# EAGLE board Hive 1.7 (EAGLE 9.6.2), part 1 of 2
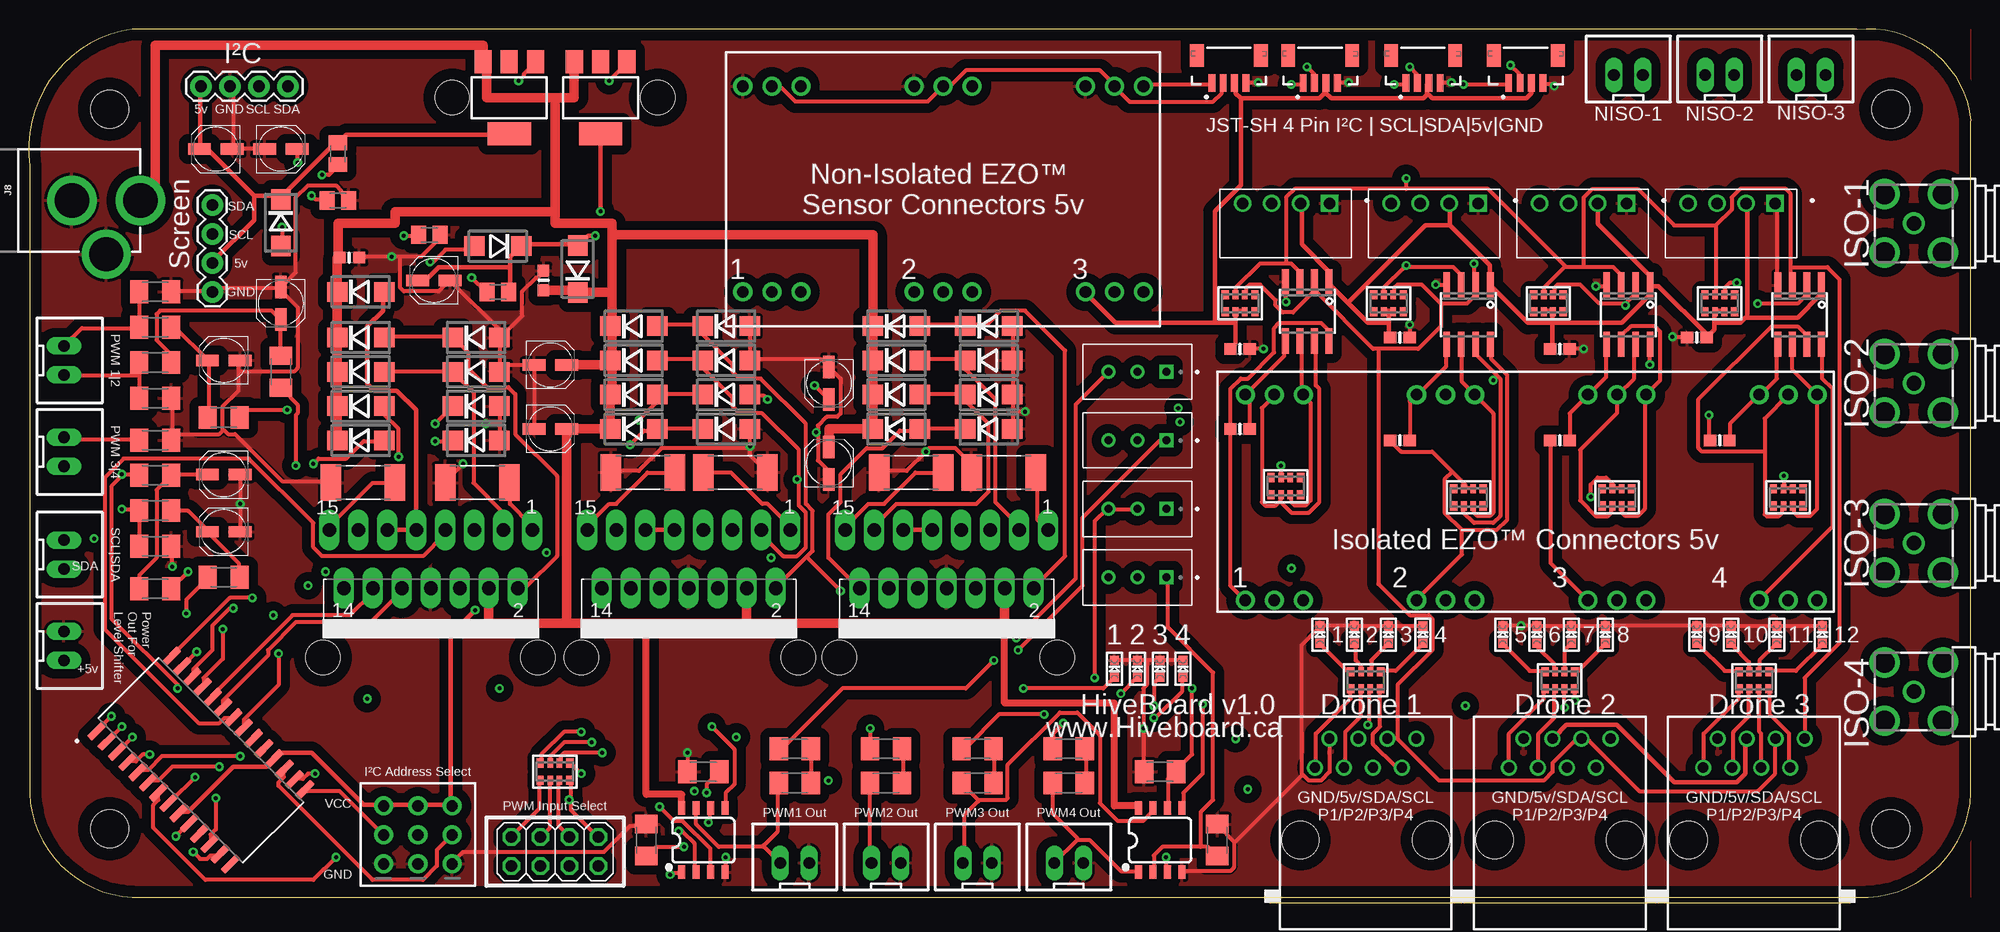
[diagram p2: board, top side]
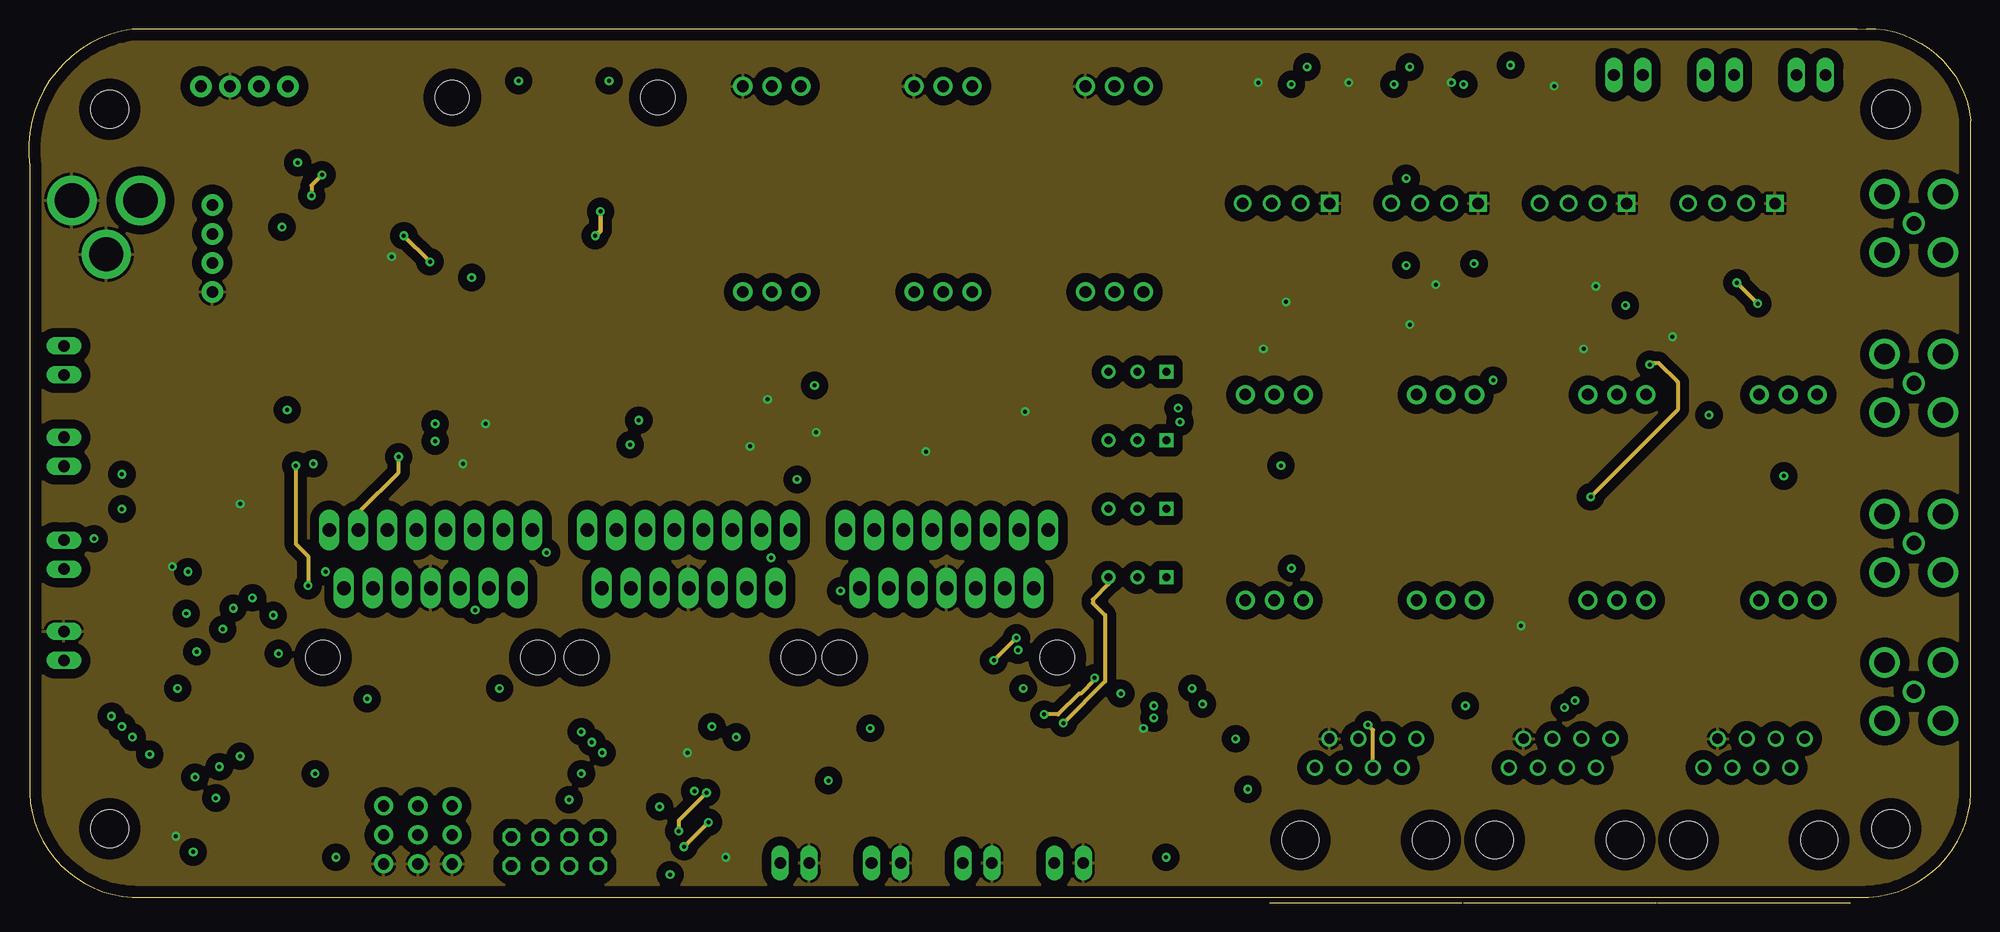
[diagram p3: board, inner layer Route2]
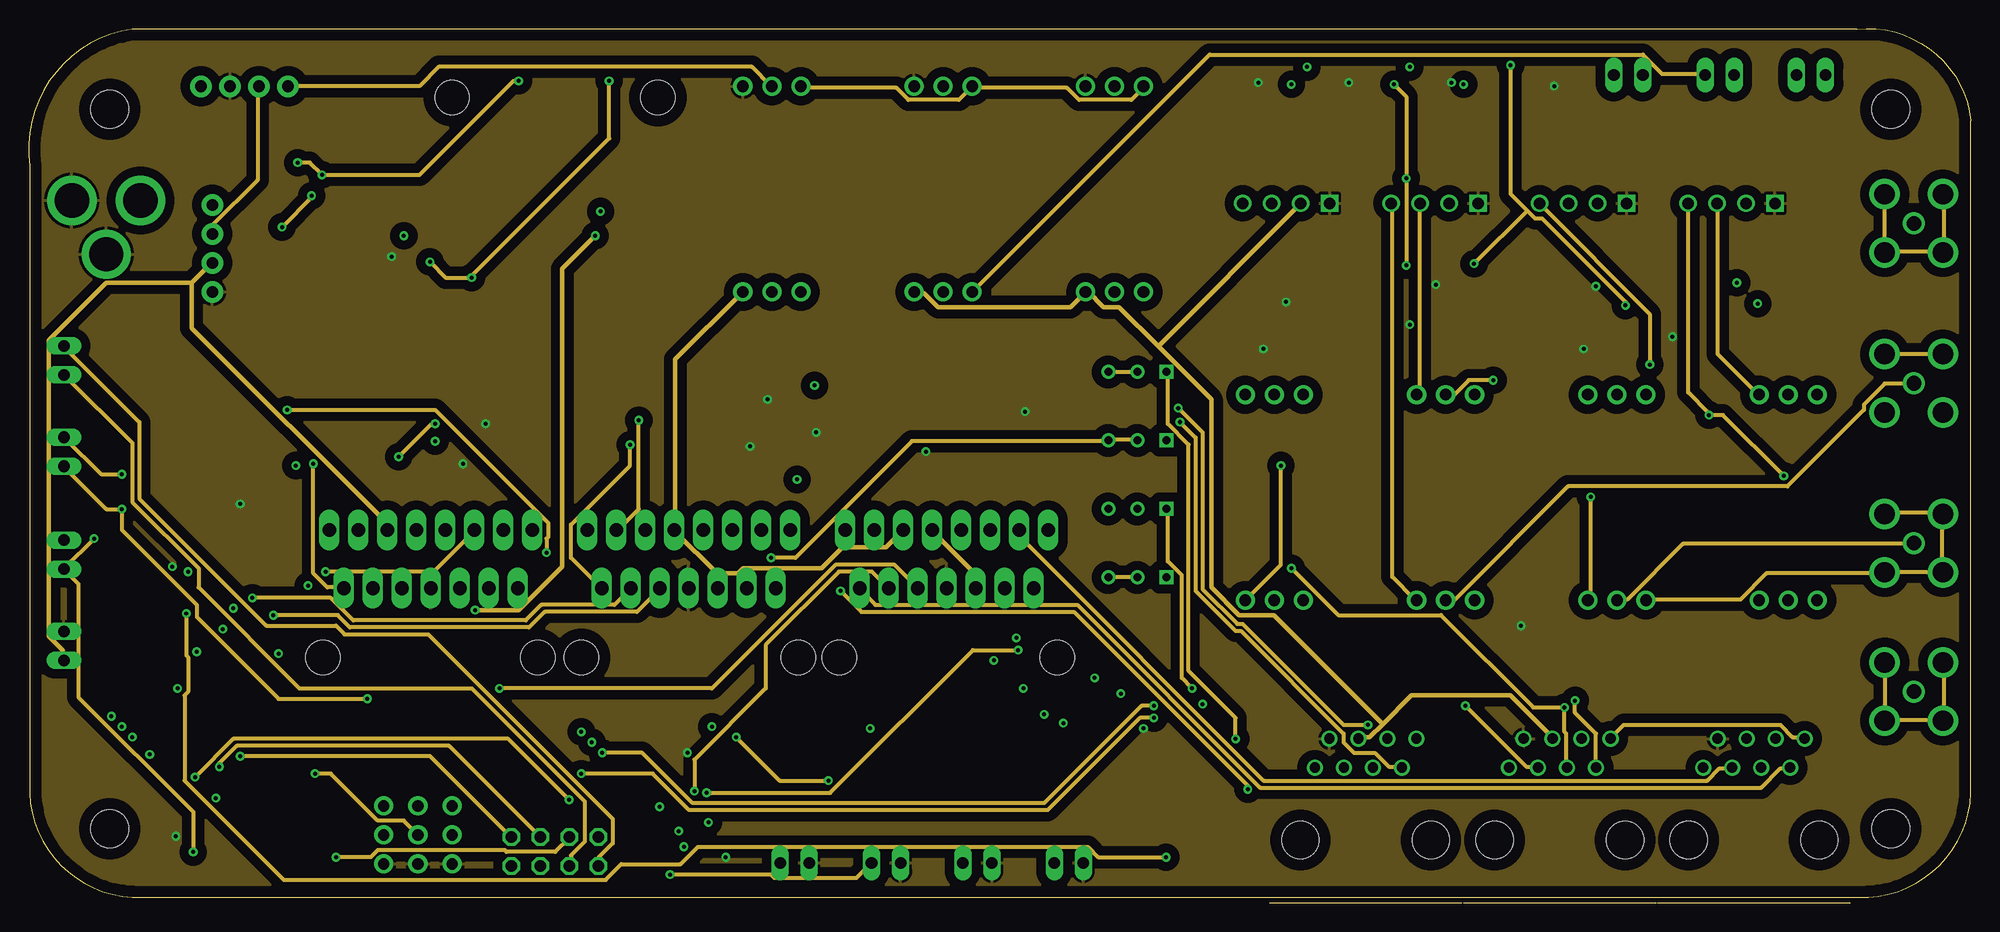
[diagram p4: board, inner layer Route15]
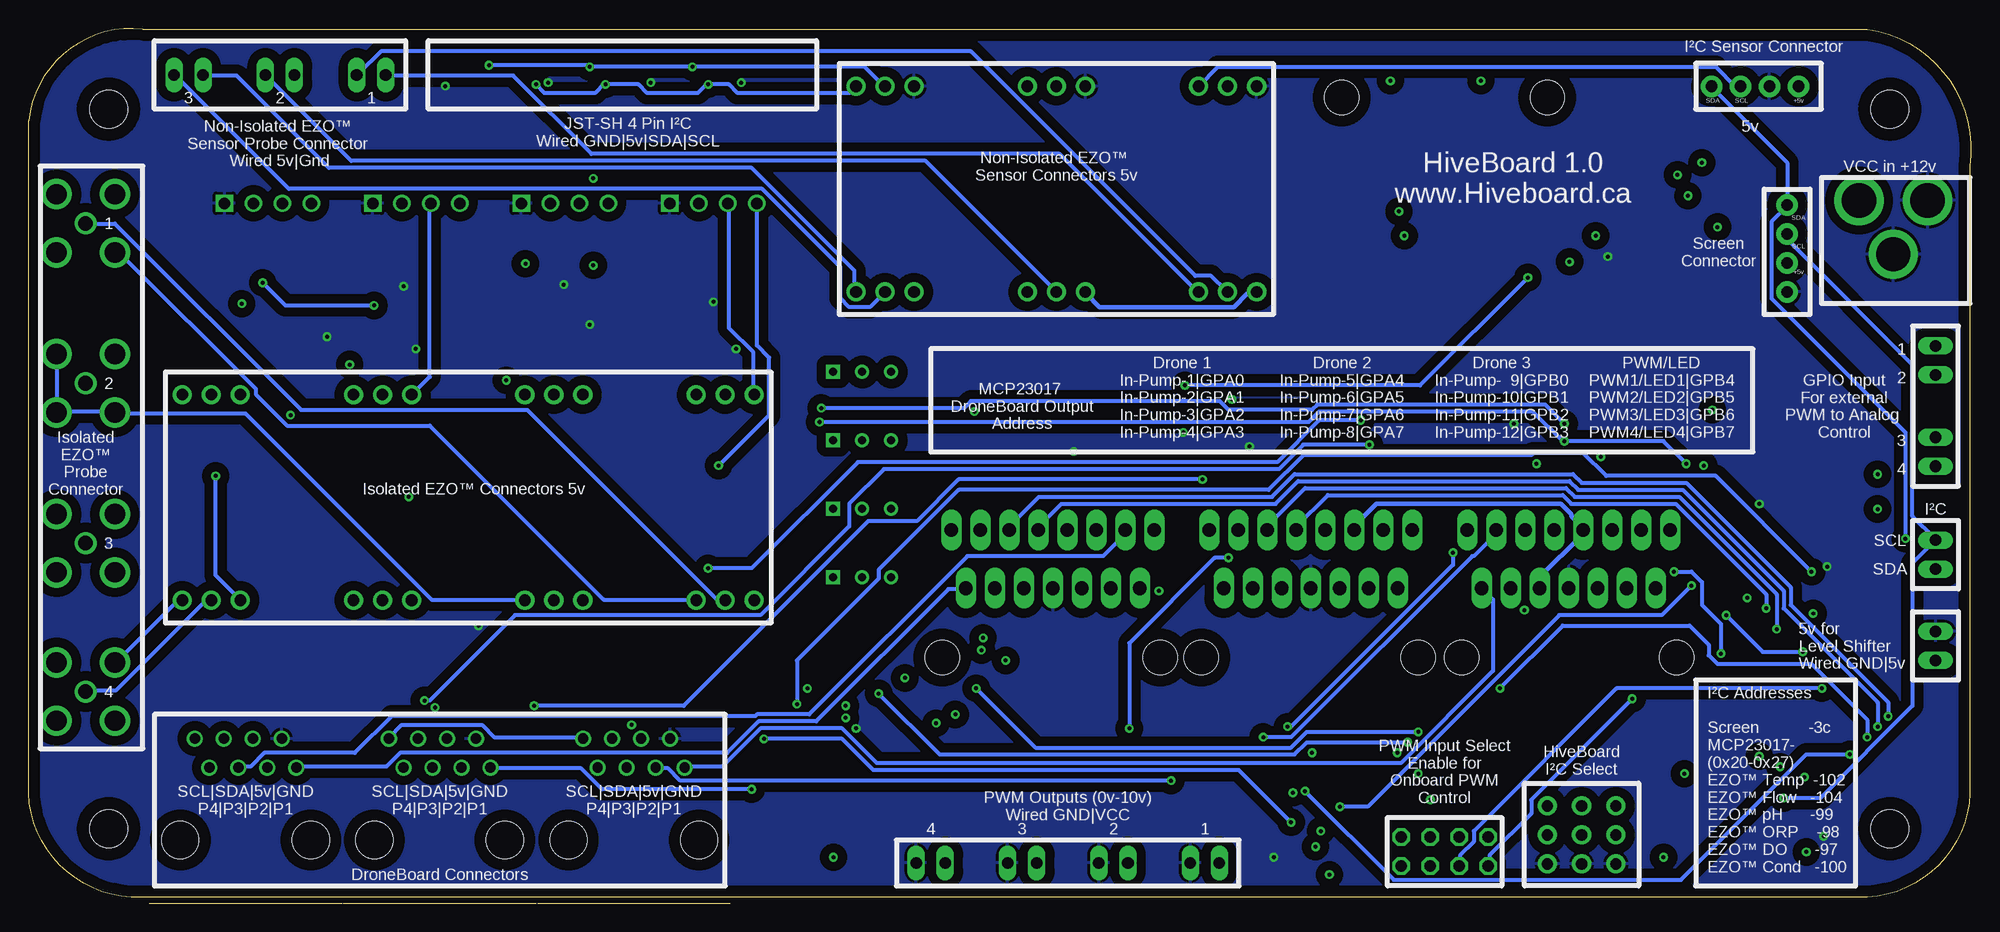
[diagram p5: board, bottom side, seen from below]

Size 170.1 x 76.05 mm. Coordinates in mm from the lower left corner, seen from the top.
Outline: 9.1,0 161.1,0 arc90 170.1,10 170.1,68 arc90 160.1,76 9.1,76 arc90 0.1,64 0.1,10 arc90 9.1,0
Copper layers (1+2*15+16): Top 0.035mm / dielectric 1.5mm / Route2 0.035mm / dielectric 0.15mm / Route15 0.035mm / dielectric 0.2mm / Bottom 0.035mm
Design rules "default *": minimum track width 6mil, minimum drill 0.35mm, track to track 6mil, track to pad 6mil, pad to pad 6mil, via to via 6mil, smd to smd 6mil, copper to edge 40mil, drill to drill 6mil, minimum pad ring 10mil, minimum via ring 8mil, stop-mask expansion 4mil, vias tented up to drill 0mil, thermal gap 10mil
Net classes: 0 default: width 0.356 mm, drill 0.102 mm, clearance 0.254 mm; 1 highpower: width 0.356 mm, drill 0.356 mm; 2 12v: width 0.457 mm, drill 0.102 mm, clearance 0.254 mm; 3 5v: width 0.406 mm, drill 0.102 mm, clearance 0.254 mm; 4 3.3v: width 0.406 mm, drill 0.102 mm, clearance 0.254 mm; 5 i2c: width 0.356 mm, drill 0.102 mm, clearance 0.254 mm; 6 GPIO: width 0.356 mm, drill 0.102 mm, clearance 0.254 mm; 8 New Class: drill 0.102 mm, clearance 0.152 mm
Holes 3 mm at 55.1,70 37.1,70 48.4,21 67.4,21 71,21 90.1,21 25.8,21 44.6,21

## Footprints (pad centres in the part's own frame; a part is rotated, then mirrored left to right if it is on the bottom)
UD-4X5,8_NICHICON = smd 2 x 1: + 1.425,0; - -1.425,0
0603-NO = smd 1.075 x 1: 1 -0.85,0; 2 0.85,0
DO214BA = smd 1.8 x 1.7: A 2.05,0; C -2.05,0
STAND-OFF = hole 3.302: 0,0
SOT223 = smd 1.5 x 2: 1 -2.3,-3.15; 2 0,-3.15; 3 2.3,-3.15 | smd 3.8 x 2: 4 0,3.15
MULTIWATT-15 = drill 1.2 long: 1 -8.89,-7.62; 2 -7.62,-2.54; 3 -6.35,-7.62; 4 -5.08,-2.54; 5 -3.81,-7.62; 6 -2.54,-2.54; 7 -1.27,-7.62; 8 0,-2.54; 9 1.27,-7.62; 10 2.54,-2.54; 11 3.81,-7.62; 12 5.08,-2.54; 13 6.35,-7.62; 14 7.62,-2.54; 15 8.89,-7.62
JST04_1MM_VERT = smd 0.6 x 1.55: 1 -1.478,0.775; 2 -0.478,0.775; 3 0.522,0.775; 4 1.522,0.775 | smd 1.2 x 2: NC1 -2.778,3.2; NC2 2.822,3.2
1X04 = drill 1.016 pad 1.88: 1 0,0; 2 2.54,0; 3 5.08,0; 4 7.62,0
POWER_JACK_PTH = drill 2.997 pad 4.318: GND 0,7.7; GNDBREAK 4.7,10.7; PWR 0,13.7
1X03_ROUND = drill 1 pad 1.676: 1 -2.54,0; 2 0,0; 3 2.54,0
2X04 = drill 1.016 octagon: 1 -3.81,-1.27; 2 -3.81,1.27; 3 -1.27,-1.27; 4 -1.27,1.27; 5 1.27,-1.27; 6 1.27,1.27; 7 3.81,-1.27; 8 3.81,1.27
1X03-CLEANBIG = drill 1.016 pad 1.676: 1 -2.54,0; 2 0,0; 3 2.54,0
CHIPLED_0603 = smd 0.8 x 0.8: A 0,-0.75; C 0,0.75
CONV_RFM-0505S = drill 1 square: 1 -3.85,-1.75 | drill 1: 2 -1.31,-1.75; 3 1.23,-1.75; 4 3.77,-1.75
R2512 = smd 1.8 x 3.2: 1 -2.8,0; 2 2.8,0
M1206 = smd 1.6 x 2: 1 -1.4,0; 2 1.4,0
M0805 = smd 1.3 x 1.6: 1 -0.95,0; 2 0.95,0
TRIM_3296W-1-103 = drill 0.71 square: 1 -2.54,0 | drill 0.71: 2 0,0; 3 2.54,0
RESPACK_4X0603 = smd 0.65 x 0.8: 1 -1.3,-0.75; 4 1.3,-0.75; 5 1.3,0.75; 8 -1.3,0.75 | smd 0.5 x 0.8: 2 -0.4,-0.75; 3 0.4,-0.75; 6 0.4,0.75; 7 -0.4,0.75
SOIC127P1030X265-28N = smd 1.9 x 0.6: 1 -4.605,8.255; 2 -4.605,6.985; 3 -4.605,5.715; 4 -4.605,4.445; 5 -4.605,3.175; 6 -4.605,1.905; 7 -4.605,0.635; 8 -4.605,-0.635; 9 -4.605,-1.905; 10 -4.605,-3.175; 11 -4.605,-4.445; 12 -4.605,-5.715; 13 -4.605,-6.985; 14 -4.605,-8.255; 15 4.605,-8.255; 16 4.605,-6.985; 17 4.605,-5.715; 18 4.605,-4.445; 19 4.605,-3.175; 20 4.605,-1.905; 21 4.605,-0.635; 22 4.605,0.635; 23 4.605,1.905; 24 4.605,3.175; 25 4.605,4.445; 26 4.605,5.715; 27 4.605,6.985; 28 4.605,8.255
SO08 = smd 0.6 x 1.2: 1 -1.905,-2.8; 2 -0.635,-2.8; 3 0.635,-2.8; 4 1.905,-2.8; 5 1.905,2.8; 6 0.635,2.8; 7 -0.635,2.8; 8 -1.905,2.8
JST-XH-02-PACKAGE-LONG-PAD = drill 1.016 long: 1 -1.27,0; 2 1.27,0
SOIC8_150MIL = smd 0.6 x 2.2: 1 -1.905,-2.6; 2 -0.635,-2.6; 3 0.635,-2.6; 4 1.905,-2.6; 5 1.905,2.6; 6 0.635,2.6; 7 -0.635,2.6; 8 -1.905,2.6
RJ45-NO-SHIELD = drill 0.9 pad 1.4: 1 -4.445,6.35; 2 -3.175,8.89; 3 -1.905,6.35; 4 -0.635,8.89; 5 0.635,6.35; 6 1.905,8.89; 7 3.175,6.35; 8 4.445,8.89 | hole 3.251: -5.715,0; 5.715,0
BU-SMA-G = drill 1.27: 1 0,0 | drill 1.778: 2 -2.55,2.55; 3 2.55,2.55; 4 2.55,-2.55; 5 -2.55,-2.55

## Placement (x,y rotation side)
C1  100nF  [UD-4X5,8_NICHICON]  45.7,41 0 top
C1A1  1uf 50v  [UD-4X5,8_NICHICON]  17.1,47 180 top
C1A2  1uf 50v  [UD-4X5,8_NICHICON]  17.1,37 180 top
C1B1  1uf 50v  [UD-4X5,8_NICHICON]  22.1,52 270 top
C1B2  1uf 50v  [UD-4X5,8_NICHICON]  17.1,32 180 top
C2  0.1uF  [0603-NO]  28.1,56 180 top
C3  1uF 50v  [UD-4X5,8_NICHICON]  16.4,65.5 180 top
C4  10uF 35v  [UD-4X5,8_NICHICON]  22.1,65.5 0 top
C5  1uf 50v  [UD-4X5,8_NICHICON]  35.5,54 180 top
C6  0.1uF  [0603-NO]  45.1,54 270 top
C7  100nF  [UD-4X5,8_NICHICON]  45.7,46.6 0 top
C8  10uF 35v  [UD-4X5,8_NICHICON]  70.1,45 270 top
C9  100nF  [UD-4X5,8_NICHICON]  70.1,38 90 top
C10  0.1uF  [0603-NO]  106.1,48 0 top
C11  0.1uF  [0603-NO]  106.1,41 0 top
C12  0.1uF  [0603-NO]  120.1,49 0 top
C13  0.1uF  [0603-NO]  120.1,40 0 top
C14  0.1uF  [0603-NO]  134.1,48 0 top
C15  0.1uF  [0603-NO]  134.1,40 0 top
C16  0.1uF  [0603-NO]  146.1,49 180 top
C17  0.1uF  [0603-NO]  148.1,40 0 top
D1  1N4002  [DO214BA]  22.1,59.05 270 top
D2  1N4002  [DO214BA]  29.1,53 0 top
D3  1N4004  [DO214BA]  29.1,49 0 top
D4  1N4004  [DO214BA]  39.2,49 0 top
D5  1N4004  [DO214BA]  29.1,46 0 top
D6  1N4004  [DO214BA]  39.2,46 0 top
D7  1N4004  [DO214BA]  29.1,43 0 top
D8  1N4004  [DO214BA]  39.2,43 0 top
D9  1N4004  [DO214BA]  29.1,40 0 top
D10  1N4004  [DO214BA]  39.2,40 0 top
D11  1N4004  [DO214BA]  41.1,57 180 top
D12  1N4004  [DO214BA]  48.1,55 90 top
D13  1N4004  [DO214BA]  53,50 0 top
D14  1N4004  [DO214BA]  53,47 0 top
D15  1N4004  [DO214BA]  53,44 0 top
D16  1N4004  [DO214BA]  53,41 0 top
D17  1N4004  [DO214BA]  61.1,50 0 top
D18  1N4004  [DO214BA]  61.1,47 0 top
D19  1N4004  [DO214BA]  61.1,44 0 top
D20  1N4004  [DO214BA]  61.1,41 0 top
D21  1N4004  [DO214BA]  76,50 0 top
D22  1N4004  [DO214BA]  84.1,50 0 top
D23  1N4004  [DO214BA]  76,47 0 top
D24  1N4004  [DO214BA]  84.1,47 0 top
D25  1N4004  [DO214BA]  76,44 0 top
D26  1N4004  [DO214BA]  84.1,44 0 top
D27  1N4004  [DO214BA]  76,41 0 top
D28  1N4004  [DO214BA]  84.1,41 0 top
H1  STAND-OFF  [STAND-OFF]  7.1,69 0 top
H2  STAND-OFF  [STAND-OFF]  7.1,6 0 top
H3  STAND-OFF  [STAND-OFF]  163.1,69 0 top
H4  STAND-OFF  [STAND-OFF]  163.1,6 0 top
IC1  LM317MBSTT3  [SOT223]  42.1,70 180 top
IC2  L298  [MULTIWATT-15]  35.23,24.52 180 top
IC3  LM317MBSTT3  [SOT223]  50.1,70 180 top
IC4  L298  [MULTIWATT-15]  57.82,24.52 180 top
IC5  L298  [MULTIWATT-15]  80.41,24.52 180 top
J1  Vertical Qwiic Connector  [JST04_1MM_VERT]  105.1,70.5 0 top
J2  C2886705  [1X04]  15.1,71 0 top
J3  C2886705  [1X04]  16.1,53 90 top
J5  Vertical Qwiic Connector  [JST04_1MM_VERT]  113.1,70.5 0 top
J6  Vertical Qwiic Connector  [JST04_1MM_VERT]  122.1,70.5 0 top
J7  Vertical Qwiic Connector  [JST04_1MM_VERT]  131.1,70.5 0 top
J8  POWER_JACK  [POWER_JACK_PTH]  -3.9,61 270 top
JP1  [1X03_ROUND]  31.1,5.46 90 top
JP2  [1X03_ROUND]  34.1,5.46 90 top
JP3  [1X03_ROUND]  37.1,5.46 90 top
JP4  [2X04]  46.1,4 0 top
JP5  C2886705  [1X03-CLEANBIG]  65.1,71 180 top
JP6  C2886705  [1X03-CLEANBIG]  65.1,53 0 top
JP7  C2886705  [1X03-CLEANBIG]  80.1,71 180 top
JP8  C2886705  [1X03-CLEANBIG]  80.1,53 0 top
JP9  C2886705  [1X03-CLEANBIG]  95.1,71 180 top
JP10  C2886705  [1X03-CLEANBIG]  95.1,53 0 top
JP12  C2886705  [1X03-CLEANBIG]  109.1,44 180 top
JP13  C2886705  [1X03-CLEANBIG]  109.1,26 0 top
JP14  C2886705  [1X03-CLEANBIG]  124.1,44 180 top
JP15  C2886705  [1X03-CLEANBIG]  124.1,26 0 top
JP16  C2886705  [1X03-CLEANBIG]  139.1,44 180 top
JP17  C2886705  [1X03-CLEANBIG]  139.1,26 0 top
JP18  C2886705  [1X03-CLEANBIG]  154.1,44 180 top
JP19  C2886705  [1X03-CLEANBIG]  154.1,26 0 top
LED1  [CHIPLED_0603]  95.1,20 0 top
LED2  [CHIPLED_0603]  97.1,20 0 top
LED3  [CHIPLED_0603]  99.1,20 0 top
LED4  [CHIPLED_0603]  101.1,20 0 top
LED5  [CHIPLED_0603]  113.1,23 0 top
LED6  [CHIPLED_0603]  116.1,23 0 top
LED7  [CHIPLED_0603]  119.1,23 0 top
LED8  [CHIPLED_0603]  122.1,23 0 top
LED9  [CHIPLED_0603]  129.1,23 0 top
LED10  [CHIPLED_0603]  132.1,23 0 top
LED11  [CHIPLED_0603]  135.1,23 0 top
LED12  [CHIPLED_0603]  138.1,23 0 top
LED13  [CHIPLED_0603]  146.1,23 0 top
LED14  [CHIPLED_0603]  149.1,23 0 top
LED15  [CHIPLED_0603]  153.1,23 0 top
LED16  [CHIPLED_0603]  157.1,23 0 top
PS1  RFM-0505S  [CONV_RFM-0505S]  110.1,59 180 top
PS2  RFM-0505S  [CONV_RFM-0505S]  123.1,59 180 top
PS3  RFM-0505S  [CONV_RFM-0505S]  136.1,59 180 top
PS4  RFM-0505S  [CONV_RFM-0505S]  149.1,59 180 top
R1  0,5 x 2W  [R2512]  39.3,36.3 0 top
R1A1  100kΩ  [M1206]  11.1,49.91 180 top
R1A2  100kΩ  [M1206]  11.1,36.93 180 top
R1B1  100kΩ  [M1206]  11.1,46.81 0 top
R1B2  100kΩ  [M1206]  11.1,33.86 0 top
R2  240Ω  [M0805]  27.1,65.1 90 top
R2A1  100kΩ  [M1206]  54.1,5 270 top
R2A2  100kΩ  [M1206]  99.1,11 0 top
R2B1  100kΩ  [M1206]  59.1,11 180 top
R2B2  100kΩ  [M1206]  104.1,5 90 top
R3  240Ω  [M0805]  41.1,53 0 top
R3-1A1  3296W-1-103  [TRIM_3296W-1-103]  97.1,46 180 top
R3-1A2  3296W-1-103  [TRIM_3296W-1-103]  97.1,34 180 top
R3-1B1  3296W-1-103  [TRIM_3296W-1-103]  97.1,40 180 top
R3-1B2  3296W-1-103  [TRIM_3296W-1-103]  97.1,28 180 top
R3-2A1  180KΩ  [M1206]  67.1,13 0 top
R3-2A2  180KΩ  [M1206]  83.1,13 0 top
R3-2B1  180KΩ  [M1206]  75.1,13 0 top
R3-2B2  180KΩ  [M1206]  91.1,13 0 top
R3-3A1  15kΩ  [M1206]  67.1,10 180 top
R3-3A2  15kΩ  [M1206]  83.1,10 180 top
R3-3B1  15kΩ  [M1206]  75.1,10 180 top
R3-3B2  15kΩ  [M1206]  91.1,10 180 top
R4  720Ω  [M0805]  27.1,61 180 top
R4A1  75kΩ  [M1206]  11.1,27 0 top
R4A2  75kΩ  [M1206]  17.1,42 0 top
R4B1  75kΩ  [M1206]  22.1,46 270 top
R4B2  75kΩ  [M1206]  17.1,28 180 top
R5  394Ω  [M0805]  35.1,58 180 top
R5A1  10kΩ  [M1206]  11.1,53 0 top
R5A2  10kΩ  [M1206]  11.1,40 0 top
R5B1  10kΩ  [M1206]  11.1,43.69 0 top
R5B2  10kΩ  [M1206]  11.1,30.73 0 top
R6  0,5 x 2W  [R2512]  29.3,36.3 0 top
R7  10kΩ  [RESPACK_4X0603]  46.1,11 0 top
R8  0,5 x 2W  [R2512]  53.8,37.2 0 top
R9  0,5 x 2W  [R2512]  61.9,37.2 180 top
R10  0,5 x 2W  [R2512]  77.3,37.2 0 top
R11  0,5 x 2W  [R2512]  85.4,37.2 0 top
R12  10KΩ  [RESPACK_4X0603]  106.1,52 180 top
R13  10KΩ  [RESPACK_4X0603]  119.1,52 180 top
R14  10KΩ  [RESPACK_4X0603]  110.1,36 0 top
R15  10kΩ  [RESPACK_4X0603]  117.1,19 0 top
R16  10KΩ  [RESPACK_4X0603]  126.1,35 0 top
R17  10KΩ  [RESPACK_4X0603]  133.1,52 180 top
R18  10KΩ  [RESPACK_4X0603]  139.1,35 0 top
R19  10kΩ  [RESPACK_4X0603]  134.1,19 0 top
R20  10KΩ  [RESPACK_4X0603]  148.1,52 180 top
R21  10KΩ  [RESPACK_4X0603]  154.1,35 0 top
R22  10kΩ  [RESPACK_4X0603]  151.1,19 0 top
U1  MCP23017-E/SO  [SOIC127P1030X265-28N]  15.1,12 45 top
U2  LM358  [SO08]  59.1,5 0 top
U3  LM358  [SO08]  99.1,5 0 top
X1  PWM-IN  [JST-XH-02-PACKAGE-LONG-PAD]  3.1,47 270 top
X2  PWM-IN  [JST-XH-02-PACKAGE-LONG-PAD]  3.1,39 270 top
X3  jst-xh-2  [JST-XH-02-PACKAGE-LONG-PAD]  3.1,30 270 top
X4  PWM1  [JST-XH-02-PACKAGE-LONG-PAD]  67.1,3 0 top
X5  PWM2  [JST-XH-02-PACKAGE-LONG-PAD]  75.1,3 0 top
X6  PWM3  [JST-XH-02-PACKAGE-LONG-PAD]  83.1,3 0 top
X7  PWM2  [JST-XH-02-PACKAGE-LONG-PAD]  91.1,3 0 top
X8  ISO154X  [SOIC8_150MIL]  111.99,51.3 180 top
X9  RJ45-6L-B  [RJ45-NO-SHIELD]  117.1,5 0 top
X10  ISO154X  [SOIC8_150MIL]  126.1,51 180 top
X11  jst-xh-2  [JST-XH-02-PACKAGE-LONG-PAD]  140.1,72 0 top
X12  ISO154X  [SOIC8_150MIL]  140.1,51 180 top
X13  RJ45-6L-B  [RJ45-NO-SHIELD]  134.1,5 0 top
X14  jst-xh-2  [JST-XH-02-PACKAGE-LONG-PAD]  148.1,72 0 top
X15  ISO154X  [SOIC8_150MIL]  155.1,51 180 top
X16  RJ45-6L-B  [RJ45-NO-SHIELD]  151.1,5 0 top
X17  jst-xh-2  [JST-XH-02-PACKAGE-LONG-PAD]  156.1,72 0 top
X18  BU-SMA-G  [BU-SMA-G]  165.1,59 0 top
X19  BU-SMA-G  [BU-SMA-G]  165.1,45 0 top
X20  BU-SMA-G  [BU-SMA-G]  165.1,31 0 top
X21  BU-SMA-G  [BU-SMA-G]  165.1,18 0 top
X22  jst-xh-2  [JST-XH-02-PACKAGE-LONG-PAD]  3.1,22 270 top

## Tracks (layer width: path | path; a pad name or v marks a point on that pad's centre or on a via)
+3.3V  (via drill 0.35)
  Top 0.406: U1.9 13.2,7.47 13.96,7.47 17.93,11.43 20.82,11.43 21.43,12.04 U1.18 21.58,12.19 22.04,12.65 24.79,12.65 29.36,8.08 31.03,8.08 JP1.3 31.19,8.08 34.08,8.08 JP2.3 34.23,8.08 36.98,8.08 JP3.3 36.98,8.23 36.98,23.01 v39.11,25.15 | 42.16,55.17 42.16,56.08 43.07,57 D11.C 43.23,57.15 47.95,57.15 D12.A 48.25,57.15 49.02,57.91 v49.63,57.91 | 42.16,55.17 42.16,53.03 R3.2 | 42.16,55.17 35.91,55.17 34.84,54.1 34.08,54.1 C5.+ | v50.08,60.05 50.08,66.75 IC3.4
  Route2 0.406: v50.08,60.05 50.08,58.37 v49.63,57.91
  Route15 0.406: v39.11,25.15 42.92,25.15 46.73,28.96 46.73,55.02 v49.63,57.91
+5V
  Top 0.406: J2.1 15.03,70.87 15.03,65.53 C3.+ 15.18,65.53 15.64,65.53 19.76,61.42 | IC1.4 42.01,66.75 27.83,66.75 27.22,66.14 R2.2 27.07,65.99 26.77,65.99 22.19,61.42 22.19,61.11 D1.C 22.04,61.42 19.76,61.42 | 19.76,61.42 19.76,59.28 16.1,55.63 J3.2 | D2.A 31.03,52.88 31.03,51.36 29.66,49.99 29.66,44.96 30.27,44.35 32.25,44.35 33.93,42.67 33.93,32.16 IC2.9 33.78,32.16 31.49,32.16 IC2.11 | IC4.11 54.05,32.16 56.48,32.16 IC4.9 | IC5.11 76.6,32.16 79.04,32.16 IC5.9 | R20.7 148.38,51.36 147.77,51.36 R20.6 147.62,51.21 147.62,50.29 | 147.62,50.29 147.62,49.68 147.01,49.07 C16.1 147.01,49.23 142.74,53.49 142.13,53.49 X12.1 | 150.52,50.75 150.36,50.75 149.91,50.29 147.62,50.29 | 150.52,50.75 154.93,50.75 156.92,52.73 156.92,53.49 X15.1 | PS3.2 137.41,60.66 137.41,58.98 141.98,54.41 141.98,53.8 X12.1 | 150.52,50.75 150.52,60.66 PS4.2 | 119.12,51.36 119.43,51.36 R13.7 | 119.12,51.36 118.82,51.36 R13.6 | 119.12,50.29 119.12,49.07 C12.1 | 119.12,50.29 119.12,51.36 | 119.12,50.29 117.29,50.29 115.54,52.05 | 115.54,52.05 113.79,53.8 X8.1 113.94,54.1 113.94,54.71 111.5,57.15 111.5,60.66 PS1.2 | R17.6 132.84,51.36 133.45,51.36 R17.7 133.45,51.05 133.45,50.29 | 133.45,50.29 133.45,48.16 133.29,48.01 C14.1 | 133.45,50.29 131.31,50.29 128.11,53.49 X10.1 127.96,53.8 127.96,55.32 124.45,58.83 | 124.45,58.83 124.45,60.66 PS2.2 | 115.54,52.05 122.32,58.83 124.45,58.83 | 133.45,50.29 139.54,50.29 142.13,52.88 142.13,53.34 X12.1 | X16.4 150.36,13.87 150.36,10.82 149.6,10.06 144.11,10.06 139.09,15.09 134.67,15.09 133.6,14.02 X13.4 | 106.17,69.95 105.71,70.41 105.71,71.17 J1.3 | 106.17,69.95 113.02,69.95 113.48,70.41
  Top 0.406: 113.48,70.41 113.48,71.17 J5.3 | 122.47,70.26 122.47,71.17 J6.3 | 122.47,70.26 122.17,69.95 114.09,69.95 113.63,70.41 113.48,70.41 | J7.3 131.62,71.17 131.62,70.41 131.16,69.95 122.93,69.95 122.63,70.26 122.47,70.26 | R12.7 106.47,51.36 105.71,51.36 R12.6 105.71,51.05 105.71,50.29 | 105.71,50.29 105.71,48.46 C10.1 | 103.88,50.29 95.19,50.29 92.6,52.88 JP10.1 | 103.88,50.29 105.71,50.29 | 106.17,69.95 106.17,62.33 103.88,60.05 103.88,50.29
  Route15 0.406: 14.27,53.8 6.8,53.8 1.77,48.77 1.77,22.86 2.99,21.64 2.99,20.88 X22.2 | 14.27,53.8 15.95,55.47 J3.2 | 60.29,28.35 60.29,27.13 IC4.6 | 60.29,28.35 56.64,32 IC4.9 56.64,32.31 56.64,47.09 62.43,52.88 JP6.1 | IC5.6 82.85,27.13 82.85,28.35 79.19,32 IC5.9 | 60.29,28.35 62.12,28.35 62.58,28.8 69.44,28.8 71.27,30.63 75.08,30.63 76.45,32 IC5.11 | 118.59,15.16 121.1,17.68 129.79,17.68 133.45,14.02 X13.4 | 118.59,15.16 117.44,14.02 116.53,14.02 X9.4 | JP8.1 77.67,52.88 78.43,52.88 79.65,51.66 91.23,51.66 92.45,52.88 JP10.1 92.76,53.03 94.13,51.66 95.5,51.66 98.93,48.23 | 118.59,15.16 109.06,24.69 106.01,24.69 103.58,27.13 103.58,43.59 98.93,48.23 | 98.93,48.23 111.35,60.66 PS1.2 | 14.27,53.8 14.27,49.84 31.34,32.77 31.34,32.16 IC2.11
  Bottom 0.406: IC2.6 37.74,27.13 37.74,28.04 34.08,31.7 34.08,32 IC2.9 33.93,32.31 35,33.38 35,33.53 35.91,34.44 52.06,34.44 53.89,32.61 53.89,32.16 IC4.11 | JP6.1 62.58,52.88 63.34,52.88 64.56,51.66 76.3,51.66 77.52,52.88 JP8.1
+12V
  Top 0.61: U2.8 57.19,9 54.1,9 54.1,24 | U3.8 97.19,8 95.1,8 95.1,17 85.49,17 85.49,23 | C2.2 27.1,56
  Top 0.813: IC1.3 39.8,73 | IC3.3 47.8,70 46.1,70 | 46.1,70 40.1,70 40.1,73.15 IC1.3 | 46.1,70 46.1,60 | 46.1,60 46.1,59 51.1,59 51.1,58 | 51.1,50 D13.C | 51.1,58 51.1,52.95 | 51.1,52.95 51.1,50 | 51.1,52.95 D12.C 48.1,53.15 C6.2 | 51.1,47 51.1,50 | D14.C 51.1,47 | 51.1,47 51.1,46.6 | 51.1,46.6 51.1,44 D15.C D16.C C1.+ 47.12,24 | C7.+ 51.1,46.6 | 51.1,58 73.95,58 D21.C D23.C D25.C D27.C 70.1,41 C9.+ | IC2.4 40.31,24 47.12,24 | 47.12,24 54.1,24 62.9,24 | 62.9,24 IC4.4 | 62.9,24 85.49,24 | 85.49,23 85.49,24 | 85.49,24 IC5.4 | D9.C D7.C D5.C D3.C D2.C 27.05,56 C2.2 | 27.1,56 27.1,59 32.1,59 32.1,60 46.1,60 | IC1.3 39.8,74.58 11.1,74.58 11.1,61 J8.PWR
GND  (via drill 0.35)
  Top 0.356: 32.56,56.08 34.39,56.08 35.91,57.61 35.91,57.91 R5.1 | 32.56,56.08 v31.8,56.08 29.05,56.08 C2.1 | C1.- 44.29,41.15 44.29,46.48 C7.- 44.14,46.63 41.4,46.63 D6.A 41.24,46.02 41.24,48.92 D4.A | C6.1 45.05,54.71 44.6,54.25 44.44,54.25 43.23,53.03 43.23,50.9 41.4,49.07 D4.A | D4.A 41.55,49.38 36.98,53.95 C5.- 36.82,53.95 35.91,53.03 32.86,53.03 32.56,53.34 32.56,56.08 | R5B1.2 12.59,43.59 12.59,40.08 R5A2.2 12.75,40.54 16.71,40.54 17.01,40.84 | 18.38,46.02 18.38,44.35 17.01,42.98 17.01,40.84 | 18.38,46.02 18.38,46.94 C1A1.- | R6.1 26.46,36.42 22.19,36.42 18.08,40.54 17.47,40.54 17.17,40.84 17.01,40.84 | LED9.C 129.18,23.77 v130.7,23.77 132.07,23.77 LED10.C 132.23,23.77 134.97,23.77 LED11.C 135.28,23.77 138.02,23.77 LED12.C 138.17,23.77 145.94,23.77 LED13.C 146.25,23.77 148.99,23.77 LED14.C 149.14,23.77 152.95,23.77 LED15.C 153.26,23.77 157.07,23.77 LED16.C | D17.A 63.19,49.99 63.19,47.09 D18.A 63.34,47.09 69.44,47.09 70.05,46.48 C8.- 70.2,46.33 71.11,45.41 71.11,42.37 70.81,42.06 69.9,42.06 69.13,41.3 69.13,40.69 | 69.13,40.69 69.13,38.25 70.05,37.34 70.05,36.58 C9.- | 63.19,39.32 63.19,38.71 64.56,37.34 R9.1 | 63.19,39.32 v63.19,39.47 63.19,41 D20.A | 63.19,39.32 55.42,39.32 53.44,37.34 51,37.34 R8.1 | R4.1 27.99,61.11 27.38,61.72 27.38,61.87 26.92,62.33 24.48,62.33 23.41,61.27 23.41,54.71 22.19,53.49 C1B1.- | LED1.C 95.19,20.73 97.02,20.73 LED2.C 97.18,20.73 97.94,20.73 | LED4.C 100.99,20.73 99.16,20.73 LED3.C 99,20.73 97.94,20.73 | 97.94,20.73 97.94,18.59 97.63,18.29 v97.63,14.78 97.63,11.12 R2A2.1 | R10.1 74.62,37.34 76.91,37.34 v78.58,39.01 78.89,39.32 81.17,39.32 82.54,37.95 82.54,37.34 R11.1
  Top 0.356: 86.2,42.52 86.2,43.89 D26.A 86.2,44.04 86.2,46.94 D24.A 86.2,47.09 86.2,49.99 D22.A | 86.2,42.52 86.2,41.15 D28.A | 105.56,4.88 105.56,2.59 105.25,2.29 101.14,2.29 U3.4 | 105.56,4.88 104.19,6.25 R2B2.2 | LED8.C 122.02,23.77 119.27,23.77 LED7.C 118.97,23.77 116.23,23.77 LED6.C 116.07,23.77 113.18,23.77 LED5.C 113.02,23.62 111.5,22.1 111.5,10.82 | C1B2.- v18.54,34.44 18.54,36.88 C1A2.- | C4.- 20.67,65.53 17.93,65.53 C3.- 17.93,65.68 17.93,70.71 17.77,70.87 J2.2 | 41.24,41.45 41.24,42.98 D8.A | 41.24,41.45 41.24,40.08 D10.A | v108.15,48.01 107.08,48.01 C10.2 | v120.95,50.14 120.95,49.07 C12.2 | v136.19,48.01 134.97,48.01 C14.2 | v143.96,49.07 145.18,49.07 C16.2 | v61.06,3.5 61.06,2.29 U2.4 | v107.69,71.32 106.62,71.32 J1.4 | v115.62,71.32 114.7,71.32 J5.4 | v124.61,71.32 123.69,71.32 J6.4 | v133.6,71.02 133.45,71.17 132.68,71.17 J7.4 | v64.71,43.59 64.41,43.89 63.19,43.89 D19.A | v12.9,5.33 13.96,6.4 U1.10 | v12.59,28.96 12.59,30.63 R5B2.2 | R5A1.2 12.59,53.03 15.95,53.03 J3.1 16.25,53.03 16.56,53.34 22.04,53.34 C1B1.- | R2A1.1 54.05,6.25 52.67,6.25 50.39,3.96 38.04,3.96 37.13,3.05 JP3.1 | v57.7,12.65 57.7,11.12 R2B1.2 | v110.13,52.12 110.13,53.8 X8.4 | v123.24,53.65 124.15,53.65 X10.4 | v137.26,53.49 138.17,53.49 X12.4 | X15.4 153.11,53.65 153.11,60.5 152.95,60.66 PS4.1 | v40.03,41.45 41.24,41.45 | v38.04,37.95 36.52,36.42 R1.1 | 111.5,10.82 112.11,10.21 113.18,10.21 113.94,10.97 113.94,13.87 X9.2 | 105.56,4.88 105.71,4.88 111.5,10.67 111.5,10.82 | v87.27,42.52 86.2,42.52 | v68.98,40.69 69.13,40.69 | 18.38,46.02 23.26,46.02 23.57,46.33 23.57,51.66 22.04,53.19 C1B1.-
  pour Top (isolate 0.813): 170.1,0 170.1,53 170.1,76
  pour Route2 (isolate 0.813): 0.1,0 170.1,0 170.1,53 170.1,76 66.1,76 0.1,76
  pour Top (isolate 0.813): 0.1,0 170.1,0 170.1,50 170.1,76 63.1,76 0.1,76
  pour Route15 (isolate 0.813): 0.1,0 170.1,0 170.1,53 170.1,76 74.1,76 0.1,76
  pour Bottom (isolate 0.813): 0.1,0 170.1,0 170.1,53 170.1,76 67.1,76 0.1,76
IN-PUMP-1  (via drill 0.35)
  Top 0.356: v21.89,21.34 21.89,18.59 18.84,15.54 18.84,14.94 U1.21
  Route15 0.356: v26,28.5 35.45,28.5 38.96,32 IC2.5
  Bottom 0.356: v21.89,21.34 21.89,23.93 23.57,25.6 23.57,27.58 24.48,28.5 v26,28.5
IN-PUMP-2
  Top 0.356: U1.22 17.77,15.7 17.17,15.7 16.71,15.24 14.88,15.24 6.65,23.47 6.65,36.73 8.33,38.41 19.3,38.41 24.94,32.77 24.94,30.63 25.7,29.87 34.54,29.87 36.37,31.7 36.37,32 IC2.7
IN-PUMP-3
  Top 0.356: U1.23 17.01,16.61 17.01,17.22 20.98,21.18 20.98,21.64 23.41,24.08 29.97,24.08 32.56,26.67 32.56,26.98 IC2.10
IN-PUMP-4
  Top 0.356: U1.24 16.25,17.53 16.25,17.83 23.11,24.69 28.14,24.69 30.12,26.67 30.12,26.98 IC2.12
IN-PUMP-5  (via drill 0.35)
  Top 0.356: v17.01,23.47 17.01,20.88 15.34,19.2 15.34,18.44 U1.25
  Bottom 0.356: v17.01,23.47 17.01,26.52 25.55,35.05 34.69,35.05 35.45,35.81 58.31,35.81 61.51,32.61 61.51,32.16 IC4.5
IN-PUMP-6  (via drill 0.35)
  Top 0.356: v17.93,25.3 17.62,25.3 16.1,23.77 16.1,21.64 14.42,19.96 14.42,19.36 U1.26
  Bottom 0.356: v17.93,25.3 17.93,26.52 25.85,34.44 35,34.44 35.76,35.2 56.33,35.2 59.08,32.46 59.08,32.16 IC4.7
IN-PUMP-7  (via drill 0.35)
  Top 0.356: v14.73,21.49 13.51,20.27 U1.27
  Route15 0.356: v21.43,24.69 27.07,24.69 28.14,23.62 43.84,23.62 45.21,24.99 53.28,24.99 55.27,26.98 IC4.10
  Bottom 0.356: v14.73,21.49 18.23,21.49 v21.43,24.69
IN-PUMP-8  (via drill 0.35)
  Top 0.356: v19.6,26.21 17.62,26.21 12.59,21.18 U1.28
  Route15 0.356: v19.6,26.21 26.46,26.21 28.44,24.23 43.53,24.23 44.9,25.6 51.3,25.6 52.67,26.98 IC4.12
IN-PUMP-9  (via drill 0.35)
  Top 0.356: v7.26,15.85 6.04,14.63 U1.1
  Bottom 0.356: v7.26,15.85 7.26,17.07 15.79,25.6 15.79,27.13 24.94,36.27 34.08,36.27 34.84,37.03 59.23,37.03 61.21,35.05 81.63,35.05 84.07,32.61 84.07,32.16 IC5.5
IN-PUMP-10  (via drill 0.35)
  Top 0.356: v8.17,14.94 6.95,13.72 U1.2
  Bottom 0.356: v8.17,14.94 8.17,17.07 16.4,25.3 16.4,26.82 25.24,35.66 34.39,35.66 35.15,36.42 58.92,36.42 60.9,34.44 79.65,34.44 81.63,32.46 81.63,32.16 IC5.7
IN-PUMP-11  (via drill 0.35)
  Top 0.356: v9.09,14.02 7.87,12.8 U1.3
  Route15 0.356: v41.24,18.29 59.84,18.29 70.66,29.11 75.84,29.11 77.82,27.13 IC5.10
  Bottom 0.356: v9.09,14.02 9.09,15.54 13.96,20.42 22.19,20.42 22.96,21.18 22.96,22.1 24.63,23.77 35.76,23.77 v41.24,18.29
IN-PUMP-12  (via drill 0.35)
  Top 0.356: v10.61,12.5 10,12.5 9.39,11.89 8.78,11.89 U1.4
  Route15 0.356: v58.31,9.3 58.31,12.04 64.56,18.29 64.56,22.1 70.96,28.5 73.86,28.5 75.23,27.13 IC5.12
  Bottom 0.356: v10.61,12.5 14.42,12.5 25.39,1.52 50.54,1.52 v58.31,9.3
IN-PWM-1
  Top 0.356: R5A1.1 9.7,52.88 9.7,49.99 R1A1.2 9.55,49.84 4.67,49.84 3.14,48.31 X1.1
  Route15 0.356: JP4.7 49.93,2.74 49.93,3.5 51.15,4.72 51.15,6.86 35,23.01 27.68,23.01 26.92,23.77 20.82,23.77 9.7,34.9 9.7,41.6 3.14,48.16 X1.1
IN-PWM-2
  Top 0.356: 9.7,45.72 9.7,46.79 R1B1.1 | 9.7,45.72 9.7,43.74 R5B1.1 | 9.7,45.72 3.14,45.72 X1.2
  Route15 0.356: JP4.5 47.49,2.74 47.49,3.66 48.71,4.88 48.71,8.38 38.81,18.29 23.72,18.29 14.88,27.13 14.88,28.8 9.09,34.59 9.09,39.78 3.14,45.72 X1.2
IN-PWM-3  (via drill 0.35)
  Top 0.356: R1A2.2 9.55,37.03 v8.17,37.03 8.17,36.88 7.26,35.97 7.26,24.38 13.05,18.59 v13.05,18.29 | R5A2.1 9.55,40.08 3.3,40.08 3.14,40.23 X2.1
  Route15 0.356: v8.17,37.03 6.34,37.03 3.14,40.23 X2.1
  Bottom 0.356: v13.05,18.29 31.03,18.29 43.53,5.79 43.53,4.88 44.75,3.66 44.75,2.74 JP4.3
IN-PWM-4  (via drill 0.35)
  Top 0.356: R5B2.1 9.7,30.79 9.7,33.83 R1B2.1 9.55,33.98 v8.17,33.98
  Route15 0.356: X2.2 3.14,37.64 6.8,33.98 v8.17,33.98 8.17,32.16 14.73,25.6 14.73,24.54 21.89,17.37 v29.66,17.37
  Bottom 0.356: v29.66,17.37 38.5,8.53 38.5,7.32 42.16,3.66 42.16,2.74 JP4.1
ISO-1-5V  (via drill 0.35)
  Top 0.356: R14.6 110.43,36.73 109.82,36.73 R14.7 109.67,36.88 v109.67,37.8 | JP13.1 106.47,26.06 105.25,27.28 C11.1 105.25,41.15 105.25,44.5 106.17,45.41 106.78,45.41 109.06,47.7 109.06,49.84 109.52,50.29 113.18,50.29 113.79,49.68 113.79,48.77 X8.8
  Route15 0.356: v109.67,37.8 109.67,29.11 106.62,26.06 JP13.1
  Bottom 0.356: v109.67,37.8 105.25,42.22 105.25,47.24 106.32,48.31 106.32,60.66 PS1.4
ISO-2-5V
  Top 0.356: R16.6 126.44,35.81 125.83,35.81 R16.7 125.83,35.97 125.83,36.12 124.68,37.26 | 124.68,37.26 122.93,39.01 120.19,39.01 119.27,39.93 C13.1 | 125.52,32.16 128.57,32.16 129.48,33.07 129.48,45.72 128.11,47.09 128.11,48.31 X10.8 | 125.52,32.16 124,33.68 124,36.58 124.68,37.26 | 125.52,32.16 125.52,30.02 121.56,26.06 JP15.1
  Route15 0.356: PS2.4 119.43,60.66 119.43,28.04 121.41,26.06 JP15.1
ISO-3-5V  (via drill 0.35)
  Top 0.356: R18.6 139.39,35.81 138.78,35.81 R18.7 138.78,35.97 138.78,36.12 138.17,36.73 137.41,36.73 136.8,36.12 v136.8,35.05 | C15.1 133.29,39.93 133.29,29.26 136.49,26.06 JP17.1 | v141.98,46.63 141.98,48.31 X12.8
  Route2 0.356: v136.8,35.05 144.42,42.67 144.42,45.11 142.74,46.79 142.13,46.79 v141.98,46.63
  Route15 0.356: v136.8,35.05 136.8,26.21 136.65,26.06 JP17.1 | v141.98,46.63 141.98,51.05 132.38,60.66 PS3.4
ISO-4-5V  (via drill 0.35)
  Top 0.356: R21.6 154.48,35.81 153.72,35.81 R21.7 153.72,35.97 v153.72,36.88 | v147.16,42.22 147.16,40.08 C17.1 | X15.8 157.07,48.31 157.07,45.41 157.98,44.5 157.98,32.46 151.58,26.06 JP19.1
  Route15 0.356: v153.72,36.88 148.38,42.22 v147.16,42.22 147.16,42.37 145.33,44.2 145.33,60.66 PS4.4
  Bottom 0.356: v153.72,36.88 153.72,28.19 151.58,26.06 JP19.1
ISO-GND-1
  Top 0.356: C11.2 106.93,41.15 106.93,43.59 106.62,43.89 JP12.3 106.62,44.04 109.98,47.4 109.98,48.62 X8.5
  Bottom 0.356: PS1.3 108.76,60.66 108.76,49.84 106.62,47.7 106.62,44.04 JP12.3
ISO-GND-2
  Top 0.356: C13.2 120.95,40.08 120.95,43.43 121.41,43.89 JP14.3 121.71,44.04 124.15,46.48 124.15,48.31 X10.5
  Route15 0.356: PS2.3 121.86,60.66 121.86,44.35 121.56,44.04 JP14.3
ISO-GND-3
  Top 0.356: C15.2 134.97,40.08 134.97,42.37 136.49,43.89 JP16.3 136.65,44.04 138.17,45.57 138.17,48.31 X12.5
  Bottom 0.356: PS3.3 134.97,60.66 134.97,45.57 136.49,44.04 JP16.3
ISO-GND-4
  Top 0.356: C17.2 148.99,40.08 148.99,41.45 151.43,43.89 JP18.3 151.73,44.04 153.11,45.41 153.11,48.31 X15.5
  Route15 0.356: PS4.3 147.92,60.66 147.92,47.55 151.43,44.04 JP18.3
ISO-PRB-1+
  Bottom 0.356: JP13.2 109.21,26.06 109.82,26.06 126.44,42.67 146.25,42.67 162.55,58.98 164.99,58.98 X18.1
ISO-PRB-1GND
  Route15 0.356: X18.3 167.74,61.42 167.74,56.54 X18.4 167.58,56.54 162.71,56.54 X18.5 162.55,56.54 162.55,61.42 X18.2
  Bottom 0.356: JP13.3 111.65,26.06 119.73,26.06 134.97,41.3 147.47,41.3 150.21,44.04 150.21,44.5 162.1,56.39 162.4,56.39 X18.5
ISO-PRB-2+
  Route15 0.356: JP15.2 124.15,26.06 124.91,26.06 134.82,35.97 154.02,35.97 160.73,42.67 160.73,43.13 162.55,44.96 164.99,44.96 X19.1
ISO-PRB-2GND
  Route15 0.356: X19.2 167.58,47.55 X19.3
  Bottom 0.356: JP15.3 126.74,26.06 134.82,26.06 151.12,42.37 162.4,42.37 X19.5 162.71,42.52 167.58,42.52 X19.4 167.58,42.67 167.58,47.55 X19.3
ISO-PRB-3+
  Route15 0.356: JP17.2 139.24,26.06 140,26.06 144.88,30.94 164.99,30.94 X20.1
ISO-PRB-3GND
  Route15 0.356: X20.2 162.55,33.68 167.58,33.68 X20.3 167.58,33.53 167.58,28.65 X20.4 167.58,28.5 162.71,28.5 X20.5 162.4,28.35 152.19,28.35 149.91,26.06 141.68,26.06 JP17.3
ISO-PRB-4+
  Bottom 0.356: JP19.2 154.17,25.91 154.63,25.91 162.4,18.14 164.99,18.14 X21.1
ISO-PRB-4GND
  Route15 0.356: X21.3 167.74,20.42 167.74,15.54 X21.4 167.58,15.54 162.71,15.54 X21.5 162.55,15.54 162.55,20.42 X21.2
  Bottom 0.356: JP19.3 156.76,25.91 157.07,25.91 162.4,20.57 X21.2
LED1  (via drill 0.35)
  Top 0.356: R7.1 44.75,10.21 44.75,7.77 42.31,5.33 JP4.2 | v18.54,12.34 11.68,12.34 10.46,11.12 9.7,11.12 U1.5
  Route15 0.356: v18.54,12.34 35.15,12.34 42.16,5.33 JP4.2
LED2  (via drill 0.35)
  Top 0.356: R7.2 45.66,10.21 45.66,6.1 44.9,5.33 JP4.4 | v16.71,11.43 12.59,11.43 11.37,10.21 10.61,10.21 U1.6
  Route15 0.356: v16.71,11.43 16.71,11.73 18.23,13.26 36.82,13.26 44.75,5.33 JP4.4
LED3  (via drill 0.35)
  Top 0.356: R7.3 46.43,10.21 46.43,6.25 47.34,5.33 JP4.6 | v26.92,3.5 24.94,1.52 15.49,1.52 10.92,6.1 10.92,8.08 11.37,8.53 11.37,9.14 U1.7
  Route15 0.356: v26.92,3.5 29.97,3.5 30.58,4.12 41.7,4.12 41.85,3.96 46.12,3.96 47.34,5.18 JP4.6
LED4  (via drill 0.35)
  Top 0.356: 47.49,8.53 47.49,7.62 49.78,5.33 JP4.8 | 47.49,8.53 47.49,10.21 R7.4 | v14.57,10.52 12.44,8.38 U1.8 | v47.34,8.53 47.49,8.53
  Route15 0.356: v14.57,10.52 17.93,13.87 42.01,13.87 v47.34,8.53
N$1
  Top 0.356: R9.2 59.23,37.19 61.51,37.19 64.26,34.44 64.71,34.44 66.7,32.46 66.7,32.16 IC4.1
N$2
  Top 0.356: R8.2 56.48,37.19 54.2,37.19 51.46,34.44 50.85,34.44 49.02,32.61 49.02,32.16 IC4.15
N$3
  Top 0.356: R11.2 88.34,37.19 88.34,33.07 89.25,32.16 IC5.1
N$4
  Top 0.356: R10.2 79.95,37.19 77.67,37.19 74.92,34.44 73.55,34.44 71.57,32.46 71.57,32.16 IC5.15
N$5  (via drill 0.35)
  Top 0.356: v32.86,57.91 34.08,57.91 R5.2 | v35.15,55.63 35.45,55.63 36.52,56.69 38.65,56.69 38.96,57 D11.A | v38.81,54.25 40.03,53.03 R3.1 | v68.83,44.81 70.05,43.59 C8.+ | v50.85,71.48 52.37,73 IC3.1
  Route2 0.356: v35.15,55.63 v32.86,57.91
  Route15 0.356: v35.15,55.63 36.52,54.25 v38.81,54.25 38.81,54.41 50.85,66.45 v50.85,71.48
  Bottom 0.356: v68.83,44.81 48.25,44.81 v38.81,54.25
N$6  (via drill 0.35)
  Top 0.356: v59.53,6.55 59.68,6.71 59.68,7.77 U2.6 | v57.4,4.42 54.96,4.42 54.2,3.66 R2A1.2
  Route2 0.356: v57.4,4.42 v59.53,6.55
  Route15 0.356: v105.71,13.87 105.71,15.7 101.59,19.81 101.59,39.62 99.77,41.45 99.77,45.87 R3-1A1.1
  Bottom 0.356: v105.71,13.87 98.85,13.87 96.11,11.12 64.1,11.12 v59.53,6.55
N$7  (via drill 0.35)
  Top 0.356: v48.41,14.48 46.88,14.48 44.9,12.5 44.9,11.89 R7.8 | v87.12,18.29 94.13,18.29 95.04,19.2 LED1.A
  Bottom 0.356: v48.41,14.48 58.16,14.48 59.53,13.11 81.94,13.11 v87.12,18.29
N$8  (via drill 0.35)
  Top 0.356: v56.94,5.79 57.25,5.79 58.31,4.72 58.31,2.29 U2.2 | v59.38,9.14 59.38,9.91 60.45,10.97 R2B1.1 | v86.66,21.64 92.3,27.28 92.3,33.22 99,39.93 99.61,39.93 R3-1B1.1
  Route2 0.356: v56.94,5.79 56.94,6.71 v59.38,9.14
  Route15 0.356: v86.66,21.64 82.7,21.64 70.2,9.14 v59.38,9.14
N$9
  Top 0.356: R1.2 42.16,36.27 42.16,34.44 43.99,32.61 43.99,32.16 IC2.1
N$10
  Top 0.356: R6.2 31.95,36.27 30.12,36.27 26.46,32.61 26.46,32.16 IC2.15
N$11  (via drill 0.35)
  Top 0.356: v24.79,61.42 25.09,61.11 26,61.11 R4.2 | v25.7,63.25 26.31,63.25 27.07,64.01 R2.1 | v22.19,58.67 22.19,57.15 D1.A | v23.57,64.31 23.57,65.38 C4.+ | v42.92,71.48 43.38,71.93 43.38,72.08 44.29,73 IC1.1
  Route2 0.356: v24.79,61.42 24.79,62.33 v25.7,63.25
  Route15 0.356: v22.19,58.67 24.79,61.27 v24.79,61.42 | v23.57,64.31 24.63,64.31 v25.7,63.25 34.23,63.25 42.46,71.48 v42.92,71.48
N$13  (via drill 0.35)
  Top 0.356: v49.32,13.56 46.88,13.56 45.66,12.34 45.66,11.89 R7.7 | v95.65,17.83 97.02,19.2 LED2.A
  Bottom 0.356: v49.32,13.56 58.16,13.56 59.23,12.5 90.32,12.5 v95.65,17.83
N$17  (via drill 0.35)
  Top 0.356: v73.71,14.78 73.71,13.11 R3-2B1.1
  Route15 0.356: v65.02,29.72 67.15,29.72 77.36,39.93 94.43,39.93 R3-1B1.3 94.58,40.08 97.02,40.08 R3-1B1.2
  Bottom 0.356: v73.71,14.78 73.71,22.25 66.24,29.72 v65.02,29.72
N$18
  Top 0.356: R3-3B1.1 76.6,10.06 76.6,12.95 R3-2B1.2
N$19  (via drill 0.35)
  Top 0.356: v84.53,20.73 82.09,18.29 71.27,18.29 66.09,13.11 65.78,13.11 R3-2A1.1 | v86.51,22.71 91.69,27.89 91.69,43.13 94.43,45.87 R3-1A1.3
  Route2 0.356: v86.51,22.71 v84.53,20.73
  Route15 0.356: R3-1A1.2 97.02,46.02 94.58,46.02 R3-1A1.3
N$20
  Top 0.356: R3-3A1.1 68.52,10.06 68.52,12.95 R3-2A1.2
N$21
  Top 0.356: R1A1.1 12.59,49.84 12.9,49.84 15.64,47.09 C1A1.+ 15.79,46.94 15.79,42.06 R4A2.1
N$22
  Top 0.356: R1B1.2 12.44,46.94 12.44,47.55 11.22,48.77 11.22,51.05 11.53,51.36 21.28,51.36 22.04,50.6 C1B1.+ 22.04,50.44 22.04,47.55 R4B1.1
N$23
  Top 0.356: R22.8 149.75,19.81 148.53,19.81 146.25,22.1 LED13.A
N$24
  Top 0.356: R22.7 150.67,19.81 150.67,20.57 149.14,22.1 LED14.A
N$25  (via drill 0.35)
  Top 0.356: v59.84,14.94 61.82,12.95 61.82,9.91 61.06,9.14 61.06,7.92 U2.5 | v22.65,42.67 19.15,42.67 18.54,42.06 R4A2.2
  Route15 0.356: v45.36,30.18 45.36,31.39 45.51,31.55 45.51,32.77 35.61,42.67 v22.65,42.67
  Bottom 0.356: v59.84,14.94 59.53,14.94 45.36,29.11 v45.36,30.18
N$26  (via drill 0.35)
  Top 0.356: v55.27,7.92 56.48,6.71 57.25,6.71 59.68,4.27 59.68,2.29 U2.3 | v23.41,37.8 23.41,42.22 23.57,42.37 23.57,43.13 22.19,44.5 R4B1.2
  Route2 0.356: v24.48,27.28 24.48,29.87 23.41,30.94 v23.41,37.8
  Bottom 0.356: v55.27,7.92 52.83,7.92 36.06,24.69 27.07,24.69 v24.48,27.28
N$27  (via drill 0.35)
  Top 0.356: v90.62,15.24 89.71,14.33 89.71,13.11 R3-2B2.1
  Route2 0.356: v90.62,15.24 94.28,18.9 94.28,24.69 93.21,25.76 93.21,26.06 94.58,27.43 94.58,27.89 R3-1B2.3
  Route15 0.356: R3-1B2.2 97.02,28.04 94.58,28.04 R3-1B2.3
N$28
  Top 0.356: R22.6 151.58,19.81 151.58,20.73 152.95,22.1 LED15.A
N$29
  Top 0.356: R22.5 152.5,19.81 154.78,19.81 157.07,22.1 LED16.A
N$30
  Top 0.356: R15.5 118.51,19.81 119.73,19.81 122.02,22.1 LED8.A
N$39
  Top 0.356: R15.6 117.6,19.81 117.6,20.73 118.97,22.1 LED7.A
N$41
  Top 0.356: LED6.A 116.23,22.1 116.23,20.73 116.68,20.27 116.68,19.81 R15.7
N$43
  Top 0.356: R15.8 115.77,19.81 115.46,19.81 113.18,22.1 LED5.A
N$44
  Top 0.356: R19.8 132.68,19.81 131.47,19.81 129.18,22.1 LED9.A
N$45
  Top 0.356: LED10.A 132.23,22.1 132.23,21.79 133.6,20.42 133.6,19.81 R19.7
N$46
  Top 0.356: R19.6 134.51,19.81 134.51,21.64 134.97,22.1 LED11.A
N$47
  Top 0.356: R19.5 135.43,19.81 135.73,19.81 138.02,22.1 LED12.A
N$48  (via drill 0.35)
  Top 0.356: v50.24,12.65 46.88,12.65 46.58,12.34 46.58,11.89 R7.6 | v98.55,16.76 98.55,18.75 99,19.2 LED3.A
  Route15 0.356: v50.24,12.65 53.74,12.65 58.16,8.23 88.95,8.23 97.48,16.76 v98.55,16.76
N$49  (via drill 0.35)
  Top 0.356: v48.41,10.82 47.49,11.73 R7.5 | v98.55,15.7 98.7,15.7 100.99,17.98 100.99,19.2 LED4.A
  Route15 0.356: v48.41,10.82 54.66,10.82 57.86,7.62 89.25,7.62 97.33,15.7 v98.55,15.7
N$50
  Top 0.356: R3-3B2.1 92.6,10.06 92.6,12.95 R3-2B2.2
N$51  (via drill 0.35)
  Top 0.356: v88.95,16 84.98,16 82.09,13.11 81.78,13.11 R3-2A2.1 | v93.37,19.2 93.37,32.92 94.43,33.98 R3-1A2.3 94.74,33.98 97.02,33.98 R3-1A2.2
  Route2 0.356: v88.95,16 90.16,16 91.99,17.83 92.15,17.83 93.37,19.05 v93.37,19.2
N$52
  Top 0.356: R3-3A2.1 84.53,10.06 84.53,12.95 R3-2A2.2
N$53
  Top 0.356: R4A1.1 9.7,27.13 9.7,28.19 11.22,29.72 11.22,35.66 12.44,36.88 R1A2.1 12.59,37.03 15.64,37.03 C1A2.+
N$54
  Top 0.356: R4B2.1 18.38,28.04 18.38,29.26 15.79,31.85 C1B2.+ 15.64,32.16 13.96,33.83 12.59,33.83 R1B2.2
N$55  (via drill 0.35)
  Top 0.356: U3.6 99.77,7.92 99.77,10.36 100.38,10.97 R2A2.2 100.53,11.12 101.9,12.5 v101.9,18.29
  Route15 0.356: v101.9,18.29 100.99,19.2 100.99,28.19 99.77,29.41 99.77,33.98 R3-1A2.1
N$56
  Top 0.356: 102.66,4.42 103.27,4.42 104.03,3.66 R2B2.1 | 102.66,4.42 99.31,4.42 98.55,3.66 98.55,2.29 U3.2 | 102.66,4.42 102.66,7.47 103.73,8.53 103.73,19.66 99.77,23.62 99.77,27.89 R3-1B2.1
N$57  (via drill 0.35)
  Top 0.356: v102.81,16.92 102.81,10.82 101.14,9.14 101.14,7.92 U3.5 | v13.96,28.5 12.59,27.13 R4A1.2
  Bottom 0.356: v102.81,16.92 102.81,20.73 95.65,27.89 95.65,28.65 88.64,35.66 61.51,35.66 58.47,38.71 38.5,38.71 38.35,38.86 33.93,38.86 31.95,36.88 22.35,36.88 v13.96,28.5
N$58  (via drill 0.35)
  Top 0.356: v99.61,3.5 99.61,2.29 U3.3 | v13.81,24.84 13.81,26.06 15.64,27.89 R4B2.2
  Route15 0.356: v99.61,3.5 93.67,3.5 92.76,4.42 58.62,4.42 57.09,2.9 51.91,2.9 50.54,1.52 22.35,1.52 13.66,10.21 13.66,17.68 13.96,17.98 13.96,21.03 13.81,21.18 v13.81,24.84
N$74
  Top 0.356: U1.15 24.33,9.3 27.22,9.3 31.03,5.49 JP1.2
N$75  (via drill 0.35)
  Top 0.356: v25.09,10.82 24.48,10.82 24.02,10.36 23.41,10.36 U1.16
  Route15 0.356: v25.09,10.82 26.46,10.82 30.58,6.71 32.86,6.71 34.08,5.49 JP2.2
N$76
  Top 0.356: U1.17 22.35,11.12 22.35,10.52 21.89,10.06 21.89,9.75 30.12,1.52 34.54,1.52 35.76,2.74 35.76,4.12 36.98,5.33 JP3.2
NISO-PRB-1+
  Bottom 0.356: X11.2 141.22,72.08 139.24,74.07 87.57,74.07 67.91,54.41 66.54,54.41 65.17,53.03 JP6.2
NISO-PRB-1GND
  Bottom 0.356: X11.1 138.78,71.93 127.66,71.93 120.8,65.08 79.8,65.08 67.76,53.03 JP6.3
NISO-PRB-2+
  Bottom 0.356: X14.2 149.3,71.93 141.83,64.47 91.54,64.47 80.11,53.03 JP8.2
NISO-PRB-2GND
  Route15 0.356: X14.1 146.71,72.08 143.05,72.08 141.37,73.76 103.42,73.76 82.7,53.03 JP8.3
NISO-PRB-3+
  Bottom 0.356: X17.2 157.22,71.93 147.31,62.03 105.86,62.03 99,55.17 99,52.43 98.24,51.66 96.41,51.66 95.19,52.88 JP10.2
NISO-PRB-3GND
  Bottom 0.356: X17.1 154.78,71.93 151.89,71.93 143.81,63.86 106.78,63.86 97.78,54.86 97.78,53.03 JP10.3
OUT-PUMP-1
  Top 0.356: R15.1 115.77,18.14 115.77,17.37 112.72,14.33 112.72,11.43 X9.1 | D3.A 31.19,49.07 37.13,49.07 D4.C 37.28,48.92 38.5,47.7 38.5,46.33 40.18,44.65 42.01,44.65 42.62,44.04 42.62,40.54 46.27,36.88 46.27,29.87 43.53,27.13 42.92,27.13 IC2.2
  Bottom 0.356: X9.1 112.57,11.43 109.37,11.43 106.01,14.78 98.85,14.78 95.8,11.73 49.93,11.73 41.85,19.81 41.85,26.06 42.77,26.98 IC2.2
OUT-PUMP-2  (via drill 0.36)
  Top 0.356: R15.2 116.68,18.14 116.68,15.85 115.31,14.48 115.31,11.43 X9.3 | D5.A 31.19,46.02 37.13,46.02 D6.C 37.28,45.87 38.96,44.2 38.96,36.27 41.55,33.68 41.55,32.16 IC2.3
  Route15 0.356: v70.05,10.21 65.78,10.21 v61.97,14.02
  Bottom 0.356: v70.05,10.21 113.02,10.21 114.09,11.28 115.16,11.28 X9.3 | v61.97,14.02 59.53,14.02 43.68,29.87 43.53,29.87 41.7,31.7 41.7,32 IC2.3
OUT-PUMP-3  (via drill 0.36)
  Top 0.356: v117.29,15.09 117.44,15.24 117.44,18.14 R15.3 | v32.41,38.56 32.41,41 31.19,42.22 31.19,42.98 D7.A | v35.61,41.45 37.13,42.98 D8.C
  Route2 0.356: v117.29,15.09 117.75,14.63 117.75,11.43 X9.5 | v32.41,38.56 32.41,37.19 29.05,33.83 29.05,33.38 28.9,33.22 28.9,32.16 IC2.13
  Route15 0.356: v35.61,41.45 35.3,41.45 v32.41,38.56 | v117.29,15.09 115.16,15.09 106.32,23.93 105.86,23.93 102.81,26.98 102.81,40.69 v100.68,42.82
  Bottom 0.356: v100.68,42.82 88.18,42.82 87.57,43.43 65.78,43.43 65.02,42.67 57.7,42.67 57.25,43.13 37.28,43.13 v35.61,41.45
OUT-PUMP-4  (via drill 0.36)
  Top 0.356: R15.4 118.36,18.14 118.36,14.94 117.75,14.33 117.75,13.41 119.73,11.43 120.19,11.43 X9.7 | v24.94,37.95 25.39,38.41 27.83,38.41 29.36,39.93 31.03,39.93 D9.A | v35.61,39.93 37.13,39.93 D10.C
  Route15 0.356: v24.94,37.95 24.94,28.35 26.16,27.13 27.53,27.13 IC2.14 | v100.83,41.6 102.2,40.23 102.2,26.82 105.71,23.32 106.17,23.32 115.16,14.33 115.16,13.56 116.07,12.65 117.9,12.65 119.12,11.43 120.19,11.43 X9.7
  Bottom 0.356: v24.94,37.95 26.92,39.93 v35.61,39.93 35.76,39.93 38.35,42.52 57.09,42.52 58.01,41.6 v100.83,41.6
OUT-PUMP-5  (via drill 0.36)
  Top 0.356: R19.1 132.68,18.14 132.68,17.37 129.64,14.33 129.64,11.43 X13.1 | D13.A 55.11,50.14 58.92,50.14 D17.C 59.08,49.84 59.08,49.23 61.67,46.63 61.67,46.02 62.28,45.41 64.1,45.41 68.07,41.45 68.07,34.44 68.68,33.83 68.68,30.33 68.14,29.79 | 68.14,29.79 65.48,27.13 IC4.2 | 68.14,29.79 v71.11,26.82
  Route15 0.356: v106.78,9.45 106.78,9.75 91.54,24.99 72.94,24.99 v71.11,26.82
  Bottom 0.356: v106.78,9.45 119.88,9.45 121.71,11.28 129.64,11.28 X13.1
OUT-PUMP-6  (via drill 0.36)
  Top 0.356: R19.2 133.6,18.14 133.6,15.7 132.23,14.33 132.23,11.43 X13.3 | D14.A 55.11,47.09 58.92,47.09 D18.C 59.08,46.94 59.08,46.33 61.67,43.74 61.67,42.98 62.28,42.37 64.26,42.37 67.46,39.17 67.46,36.58 | 67.46,36.58 67.46,34.29 68.07,33.68 68.07,30.63 67.3,29.87 66.09,29.87 64.26,31.7 64.26,32 IC4.3 | v67.3,36.58 67.46,36.58
  Route15 0.356: v125.83,16.76 131.16,11.43 132.07,11.43 X13.3
  Bottom 0.356: v125.83,16.76 112.72,16.76 96.57,32.92 92.3,32.92 88.64,36.58 v67.3,36.58
OUT-PUMP-7  (via drill 0.36)
  Top 0.356: v134.51,16.61 134.51,18.14 R19.3 | D19.C 58.92,44.04 55.11,44.04 D15.A 54.96,43.89 54.96,43.28 v53.44,41.76
  Route15 0.356: X13.5 134.67,11.43 134.67,14.33 134.51,14.48 v134.51,16.61 131.77,16.61 123.69,24.69 114.7,24.69 v110.59,28.8 | v53.44,41.76 53.44,33.98 51.61,32.16 IC4.13
  Bottom 0.356: v110.59,28.8 106.78,28.8 97.48,38.1 60.75,38.1 57.09,41.76 v53.44,41.76
OUT-PUMP-8  (via drill 0.36)
  Top 0.356: v135.43,17.22 135.43,18.14 R19.4 | D20.C 58.92,41 55.11,41 D16.A 54.96,40.84 53.89,40.84 v52.67,39.62
  Route15 0.356: v135.43,17.22 135.43,16.15 137.26,14.33 137.26,11.43 X13.7 | v52.67,39.62 52.67,37.8 47.49,32.61 47.49,29.72 50.08,27.13 IC4.14
  Bottom 0.356: v135.43,17.22 134.97,17.22 127.5,24.69 106.01,24.69 98.24,32.46 98.24,34.44 95.19,37.49 60.6,37.49 58.47,39.62 v52.67,39.62
OUT-PUMP-9
  Top 0.356: R22.1 149.75,18.14 149.75,17.37 146.71,14.33 146.71,11.43 X16.1 | D21.A 78.13,50.14 81.94,50.14 D22.C 82.09,50.14 83.92,50.14 85.14,51.36 87.27,51.36 90.77,47.85 90.77,29.87 88.03,27.13 IC5.2
  Bottom 0.356: X16.1 146.55,11.43 138.78,11.43 137.56,12.65 108.91,12.65 106.17,15.39 101.14,15.39 89.56,26.98 88.03,26.98 IC5.2
OUT-PUMP-10
  Top 0.356: R22.2 150.67,18.14 150.67,15.85 149.3,14.48 149.3,11.43 X16.3 | D23.A 78.13,47.09 81.94,47.09 D24.C 82.09,46.94 82.09,46.18 84.68,43.59 84.68,34.59 86.66,32.61 86.66,32.16 IC5.3
  Route15 0.356: X16.3 149.14,11.28 148.08,11.28 147.01,10.21 108.15,10.21 86.81,31.55 86.81,32 IC5.3
OUT-PUMP-11
  Top 0.356: R22.3 151.58,18.14 151.58,14.48 151.73,14.33 151.73,11.43 X16.5 | D25.A 78.13,44.04 81.94,44.04 D26.C 82.09,43.89 82.09,43.43 84.07,41.45 84.07,35.51 83,34.44 75.99,34.44 74.16,32.61 74.16,32.16 IC5.13
  Bottom 0.356: X16.5 151.58,11.43 150.67,11.43 149.45,12.65 141.52,12.65 138.32,15.85 106.47,15.85 106.32,16 101.75,16 87.88,29.87 75.99,29.87 74.16,31.7 74.16,32 IC5.13
OUT-PUMP-12
  Top 0.356: R22.4 152.5,18.14 152.5,16 154.17,14.33 154.17,11.43 X16.7 | D28.C 81.94,41 78.13,41 D27.A 77.97,40.84 76.3,40.84 74.77,39.32 73.4,39.32 71.11,37.03 71.11,34.59 70.05,33.53 70.05,29.72 72.64,27.13 IC5.14
  Route15 0.356: X16.7 154.17,11.28 153.41,11.28 151.73,9.6 107.84,9.6 91.84,25.6 74.16,25.6 72.79,26.98 IC5.14
PWM-OUT-1
  Top 0.356: 64.41,4.42 60.45,4.42 58.47,6.4 58.47,7.77 U2.7 | 64.41,4.42 65.78,3.05 X4.1 | R3-3A1.2 65.63,9.91 65.63,5.79 64.41,4.57 64.41,4.42
PWM-OUT-2  (via drill 0.35)
  Top 0.356: v56.18,1.98 56.33,2.13 57.09,2.13 U2.1 | R3-3B1.2 73.71,9.91 73.71,3.05 X5.1
  Route15 0.356: v56.18,1.98 65.02,1.98 65.32,1.68 72.49,1.68 73.71,2.9 X5.1
PWM-OUT-3
  Top 0.356: 83.15,8.53 85.59,8.53 85.75,8.69 85.75,11.58 90.32,16.15 91.84,16.15 93.82,14.17 93.82,8.23 95.35,6.71 97.63,6.71 98.39,7.47 98.39,7.77 U3.7 | 83.15,8.53 81.78,9.91 R3-3A2.2 | X6.1 81.94,3.05 81.94,7.16 83.15,8.38 83.15,8.53
PWM-OUT-4
  Top 0.356: 91.84,5.03 92.91,5.03 95.65,2.29 97.18,2.29 U3.1 | 91.84,5.03 89.86,3.05 X7.1 | R3-3B2.2 89.71,9.91 89.71,7.32 91.84,5.18 91.84,5.03
SCL  (via drill 0.35)
  Top 0.356: v16.4,8.69 16.4,5.94 15.95,5.49 15.95,4.72 U1.12 | 120.64,55.17 124.76,55.17 125.37,54.56 125.37,53.65 X10.3 | 120.64,55.17 120.49,55.17 118.66,53.34 118.66,52.88 R13.3 | J1.1 103.58,71.17 97.94,71.17 97.78,71.02 JP9.1 | v110.59,71.17 111.5,71.17 J5.1 | v119.58,71.17 120.49,71.17 J6.1 | v125.67,71.17 129.48,71.17 J7.1 | v120.64,55.32 120.64,55.17 | 147.77,58.83 147.77,52.88 R20.3 | 147.77,58.83 149.14,60.2 149.14,61.27 149.91,62.03 153.87,62.03 154.33,61.57 154.33,55.17 | 154.33,55.17 154.33,53.65 X15.3 | 110.13,55.47 110.59,55.47 111.35,54.71 111.35,53.95 X8.3 | 110.13,55.47 107.84,55.47 105.71,53.34 105.71,52.88 R12.3 | 134.51,55.17 132.68,53.34 132.68,52.88 R17.3 | 136.19,55.17 138.78,55.17 139.39,54.56 139.39,53.65 X12.3 | 136.19,55.17 134.51,55.17 | 110.13,55.47 110.13,61.27 110.89,62.03 120.64,62.03 | 120.64,62.03 127.81,62.03 134.51,55.32 134.51,55.17 | 147.77,58.83 144.11,58.83 140.91,62.03 136.95,62.03 136.19,61.27 136.19,55.17 | 154.33,55.17 157.53,55.17 158.59,54.1 158.59,22.25 155.54,19.2 155.54,14.02 X16.8 | 120.64,62.03 v120.64,62.94
  Route15 0.356: J3.3 16.1,58.22 16.1,58.83 20.06,62.79 20.06,70.87 J2.3 | JP5.1 67.76,70.87 75.99,70.87 77.06,69.8 81.48,69.8 82.54,70.87 JP7.1 82.7,70.87 90.93,70.87 91.99,69.8 96.57,69.8 97.63,70.87 JP9.1 | v120.64,55.32 v120.64,62.94 120.64,70.1 v119.58,71.17 | X16.8 155.39,14.02 154.48,14.02 153.41,15.09 139.69,15.09 138.63,14.02 X13.8
  Bottom 0.356: v16.4,8.69 13.2,8.69 5.13,16.76 5.13,29.26 3.14,31.24 X3.1 3.14,31.39 5.13,33.38 5.13,46.63 15.95,57.45 15.95,58.06 J3.3 | JP9.1 97.78,70.87 98.24,70.41 108,70.41 108.76,71.17 v110.59,71.17 110.74,71.17 111.5,70.41 115.92,70.41 116.68,71.17 v119.58,71.17 119.73,71.17 120.49,70.41 124.91,70.41 v125.67,71.17 | X9.8 121.56,14.02 129.33,14.02 130.4,15.09 137.41,15.09 138.48,14.02 X13.8 | J2.3 20.21,71.02 20.67,71.02 22.35,72.69 65.93,72.69 67.61,71.02 JP5.1
SCL2
  Top 0.356: R14.3 110.59,35.2 110.59,34.59 110.89,34.29 111.81,34.29 112.26,34.75 112.26,43.28 111.65,43.89 JP12.1 111.5,44.04 111.5,48.62 X8.6
SCL3
  Top 0.356: R16.3 126.59,34.14 126.59,33.68 126.89,33.38 127.96,33.38 128.26,33.68 128.26,42.37 126.74,43.89 JP14.1 126.59,44.04 125.52,45.11 125.52,48.31 X10.6
SCL4
  Top 0.356: R18.3 139.54,34.14 139.54,33.68 139.85,33.38 140.91,33.38 141.52,33.98 141.52,43.89 JP16.1 141.68,44.04 142.9,45.26 142.9,49.53 142.44,49.99 140.3,49.99 139.54,49.23 139.54,48.46 X12.6
SCL5
  Top 0.356: R21.3 154.63,34.14 154.63,33.68 154.93,33.38 156,33.38 156.61,33.98 156.61,43.89 JP18.1 156.61,44.04 154.48,46.18 154.48,48.31 X15.6
SDA  (via drill 0.35)
  Top 0.356: v14.42,3.96 15.03,3.35 15.64,3.35 15.95,3.66 16.71,3.66 U1.13 | 119.88,13.87 119.12,13.87 X9.6 | 119.88,13.87 123.54,10.21 132.68,10.21 133.45,10.97 133.45,11.73 135.58,13.87 135.88,13.87 X13.6 136.04,13.72 136.65,13.72 141.07,9.3 151.43,9.3 152.95,10.82 152.95,13.87 X16.6 | R12.2 106.62,52.88 106.62,53.34 106.93,53.65 107.84,53.65 109.21,52.27 109.21,51.82 109.82,51.21 110.74,51.21 112.57,53.03 112.57,53.8 X8.2 112.72,53.03 117.75,48.01 118.21,48.01 | 123.69,51.97 122.02,53.65 119.88,53.65 119.58,53.34 119.58,52.88 R13.2 | 123.69,51.97 125.98,51.97 126.59,52.58 126.59,53.49 X10.2 126.59,53.65 v126.59,55.47 | 118.21,48.01 121.71,48.01 123.69,49.99 123.69,51.97 | 139.85,51.97 137.56,51.97 135.88,53.65 133.9,53.65 133.6,53.34 133.6,52.88 R17.2 | 139.85,51.97 140.61,52.73 140.61,53.49 X12.2 | v149.6,53.8 148.99,53.8 148.53,53.34 148.53,52.88 R20.2 | v151.43,51.97 154.93,51.97 155.7,52.73 155.7,53.49 X15.2 | v139.85,51.82 139.85,51.97 | JP5.2 65.17,70.87 65.93,70.87 67.15,69.65 78.73,69.65 79.95,70.87 JP7.2 80.26,71.02 80.72,71.02 82.09,72.39 93.82,72.39 95.04,71.17 JP9.2 95.19,70.87 96.41,69.65 103.73,69.65 104.49,70.41 104.49,71.17 J1.2 | v111.96,72.69 112.57,72.08 112.57,71.32 J5.2 | v120.95,72.69 121.56,72.08 121.56,71.32 J6.2 | v129.79,72.85 130.55,72.08 130.55,71.32 J7.2 | 119.88,13.87 119.88,18.59 122.93,21.64 122.93,24.38 122.63,24.69 120.95,24.69 118.21,27.43 118.21,48.01
  Route2 0.356: v151.43,51.97 v149.6,53.8
  Route15 0.356: v14.42,3.96 14.42,7.47 4.36,17.53 4.36,27.43 3.14,28.65 X3.2 3.14,28.8 v5.74,31.39 | J2.4 22.8,71.02 34.23,71.02 35.91,72.69 63.34,72.69 65.02,71.02 JP5.2 | v139.85,51.82 139.85,52.12 132.53,59.44 131.92,59.44 131.24,60.12 | 131.24,60.12 129.79,61.57 v129.79,72.85 | 131.24,60.12 v126.59,55.47
  Bottom 0.356: v139.85,51.82 147.62,51.82 v149.6,53.8 | J2.4 22.65,70.87 16.1,64.31 16.1,60.66 J3.4 16.1,60.5 17.47,59.13 17.47,52.43 5.74,40.69 v5.74,31.39 | JP9.2 95.19,71.02 96.87,72.69 v111.96,72.69 v120.95,72.69 120.95,72.85 v129.79,72.85
SDA2
  Top 0.356: 109.67,34.75 109.67,35.2 R14.2 | 109.67,34.75 109.21,34.29 108.3,34.29 108,34.59 108,42.82 109.06,43.89 JP12.2 | X8.7 112.72,48.62 112.72,44.81 113.02,44.5 113.02,34.59 112.11,33.68 110.59,33.68 109.67,34.59 109.67,34.75
SDA3  (via drill 0.35)
  Top 0.356: 128.65,45.64 126.74,47.55 126.74,48.31 X10.7 | 128.65,45.64 128.87,45.41 128.87,33.38 128.26,32.77 126.59,32.77 125.67,33.68 125.67,34.14 R16.2 | 128.65,45.64 v128.26,45.26
  Route15 0.356: v128.26,45.26 126.13,45.26 124.91,44.04 124.15,44.04 JP14.2
SDA4
  Top 0.356: R18.2 138.63,34.14 138.63,33.68 138.32,33.38 137.26,33.38 135.88,34.75 135.88,39.17 139.09,42.37 139.09,43.89 JP16.2 139.24,44.04 140.61,45.41 140.61,48.31 X12.7
SDA5
  Top 0.356: 152.04,39.01 152.04,41.91 154.02,43.89 JP18.2 | 152.04,39.01 152.04,33.53 152.19,33.38 153.26,33.38 153.56,33.68 153.56,34.14 R21.2 | 152.04,39.01 146.55,39.01 146.25,39.32 146.25,43.59 152.65,49.99 154.93,49.99 155.7,49.23 155.7,48.46 X15.7